# Altium schematic sheet A2541WV-2P_2021-01-11.schdoc
size 39 x 30 mm
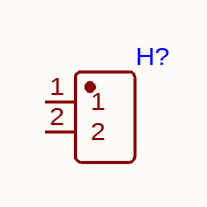
[diagram p0: A2541WV-2P_2021-01-11.schdoc]

## Parts
H?  (no value)  [HDR-TH_P2.54-H-M_A2541WV-2P]

## Nets

Not connected (* = marked no-connect by the designer): H? 1 2

## Library data of the parts
H? = A2541WV-2P